# EAGLE design arduboy-gt (EAGLE 7.7.0)
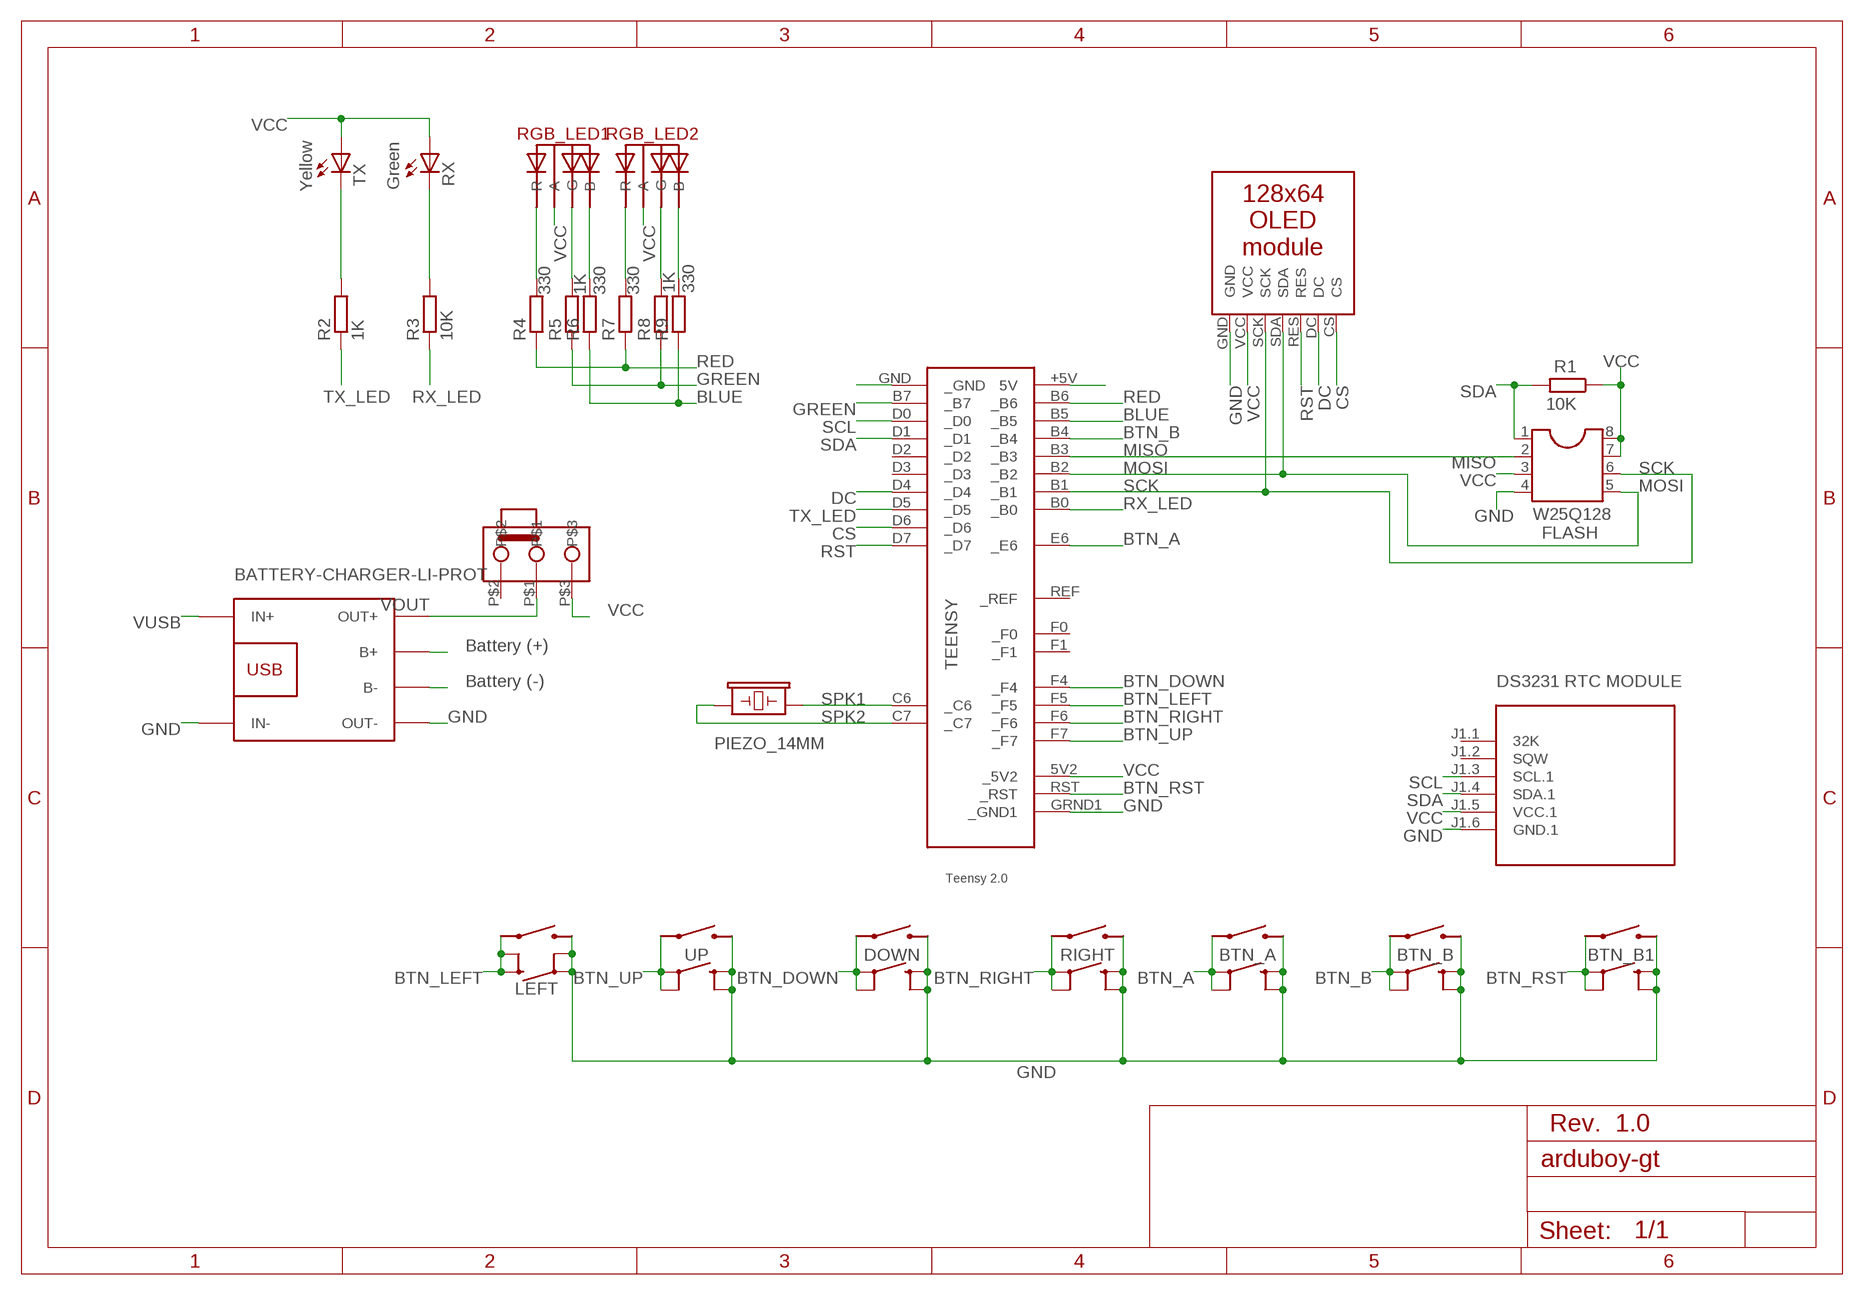
[diagram p0: schematic, sheet 1]

## Parts
_1  TEENSY  [TEENSY]
BTN_A  MOMENTARY-SWITCH-SPST-PTH-6.0MM  [TACTILE_SWITCH_PTH_6.0MM]
BTN_A_  KAIHLMICROSWITCH  [KAIHLMICROSWITCH]
BTN_B  MOMENTARY-SWITCH-SPST-PTH-6.0MM  [TACTILE_SWITCH_PTH_6.0MM]
BTN_B1  MOMENTARY-SWITCH-SPST-PTH-6.0MM  [TACTILE_SWITCH_PTH_6.0MM]
BTN_B_  KAIHLMICROSWITCH  [KAIHLMICROSWITCH]
BTN_B_1  KAIHLMICROSWITCH  [KAIHLMICROSWITCH]
DOWN  MOMENTARY-SWITCH-SPST-PTH-6.0MM  [TACTILE_SWITCH_PTH_6.0MM]
DOWN_  KAIHLMICROSWITCH  [KAIHLMICROSWITCH]
FLASH  W25Q128  DIL8  [DIL08]
LEFT  MOMENTARY-SWITCH-SPST-PTH-6.0MM  [TACTILE_SWITCH_PTH_6.0MM]
LEFT_  KAIHLMICROSWITCH  [KAIHLMICROSWITCH]
R1  10K  R-EU_0204/7  [0204/7]
R2  1K  R-EU_0204/7  [0204/7]
R3  10K  R-EU_0204/7  [0204/7]
R4  330  R-EU_0204/7  [0204/7]
R5  1K  R-EU_0204/7  [0204/7]
R6  330  R-EU_0204/7  [0204/7]
R7  330  R-EU_0204/7  [0204/7]
R8  1K  R-EU_0204/7  [0204/7]
R9  330  R-EU_0204/7  [0204/7]
RGB_LED1  5MMRGBLED-CA  [LED5MMRGB]
RGB_LED2  5MMRGBLED-CA  [LED5MMRGB]
RIGHT  MOMENTARY-SWITCH-SPST-PTH-6.0MM  [TACTILE_SWITCH_PTH_6.0MM]
RIGHT_  KAIHLMICROSWITCH  [KAIHLMICROSWITCH]
RX  TLLG4400  [LED3MM]
SG1  PIEZO_14MM  [PIEZO_14MM]
TX  TLLY4400  [LED3MM]
U$1  OLED  [OLED]
U$2  SWITCH  [SWITCH]
U$3  BATTERY-CHARGER-LI-PROT  [BATTERY-CHARGER-LI-PROT]
U$6  DS3231 RTC MODULE  RTC-DS3231-AT24C32  [RTC-DS3231-AT24C32]
UP  MOMENTARY-SWITCH-SPST-PTH-6.0MM  [TACTILE_SWITCH_PTH_6.0MM]
UP_  KAIHLMICROSWITCH  [KAIHLMICROSWITCH]

## Nets
BLUE: _1.B5(_B5) R6.1 R9.1
BTN_A: _1.E6(_E6) BTN_A.1 BTN_A.2 BTN_A_.P$1
BTN_B: _1.B4(_B4) BTN_B.1 BTN_B.2 BTN_B_.P$1
BTN_DOWN: _1.F4(_F4) DOWN.1 DOWN.2 DOWN_.P$1
BTN_LEFT: _1.F5(_F5) LEFT.3 LEFT.4 LEFT_.P$1
BTN_RIGHT: _1.F6(_F6) RIGHT.1 RIGHT.2 RIGHT_.P$1
BTN_RST: _1.RST(_RST) BTN_B1.1 BTN_B1.2 BTN_B_1.P$1
BTN_UP: _1.F7(_F7) UP.1 UP.2 UP_.P$1
CS: _1.D6(_D6) U$1.CS
DC: _1.D4(_D4) U$1.DC
GND: _1.GND(_GND) _1.GRND1(_GND1) BTN_A.3 BTN_A.4 BTN_A_.P$2 BTN_B1.3 BTN_B1.4 BTN_B.3 BTN_B.4 BTN_B_1.P$2 BTN_B_.P$2 DOWN.3 DOWN.4 DOWN_.P$2 FLASH.4 LEFT.1 LEFT.2 LEFT_.P$2 RIGHT.3 RIGHT.4 RIGHT_.P$2 U$1.GND U$3.IN- U$3.OUT- U$6.J1.6(GND.1) UP.3 UP.4 UP_.P$2
GREEN: _1.B7(_B7) R5.1 R8.1
MISO: _1.B3(_B3) FLASH.2
MOSI: _1.B2(_B2) FLASH.5 U$1.SDA
N$3: U$3.B-
N$4: U$3.B+
N$9: R7.2 RGB_LED2.R$1(R)
N$11: R8.2 RGB_LED2.G$1(G)
N$12: R9.2 RGB_LED2.B$1(B)
N$14: R6.2 RGB_LED1.B$1(B)
N$15: R5.2 RGB_LED1.G$1(G)
N$16: R4.2 RGB_LED1.R$1(R)
RED: _1.B6(_B6) R4.1 R7.1
RST: _1.D7(_D7) U$1.RES
RX_LED: _1.B0(_B0) R3.1
RX_LED_R: R3.2 RX.K(C)
SCK: _1.B1(_B1) FLASH.6 U$1.SCK
SCL: _1.D0(_D0) U$6.J1.3(SCL.1)
SDA: _1.D1(_D1) FLASH.1 R1.2 U$6.J1.4(SDA.1)
SPK1: _1.C6(_C6) SG1.P$2
SPK2: _1.C7(_C7) SG1.P$1
TX_LED: _1.D5(_D5) R2.1
TX_LED_R: R2.2 TX.K(C)
VCC: _1.5V2(_5V2) _1.+5V(5V) FLASH.3 FLASH.7 FLASH.8 R1.1 RGB_LED1.C$1(A) RGB_LED2.C$1(A) RX.A TX.A U$1.VCC U$2.P$3 U$6.J1.5(VCC.1)
VOUT: U$2.P$1 U$3.OUT+
VUSB: U$3.IN+
Unconnected: _1.D2(_D2) _1.D3(_D3) _1.F0(_F0) _1.F1(_F1) _1.REF(_REF) U$2.P$2 U$6.J1.1(32K) U$6.J1.2(SQW)

## Notes on the sheet
- Yellow | Green
- Battery (+)
- Battery (-)
- Rev.  1.0

## Library data of the parts
_1 = teensy:TEENSY: Teensy 2.0 Original Design by Clint Fisher Modified Design by Tamir Emran Licensed Under Creative Commons Attribution-ShareAlike 3.0 Unported (CC BY-SA 3.0)
BTN_A BTN_B BTN_B1 DOWN LEFT RIGHT UP = libavr-hvsp-programmer:MOMENTARY-SWITCH-SPST: Momentary Switch (Pushbutton) - SPST Normally-open (NO) SPST momentary switches (buttons, pushbuttons). Variants PTH-12MM - 12mm square, through-hole Momentary Pushbutton Switch - 12mm Square <https://www.sparkfun.com/products/9190> (COM-09190) PTH-6.0MM, PTH-6.0MM-KIT - 6.0mm square, through-hole Mini Pushbutton Switch <https://www.sparkfun.com/products/97> (COM-00097) KIT package intended for soldering kit's - only one side of pads' copper is exposed. PTH-RIGHT-ANGLE-KIT - Right-angle, through-hole Right Angle Tactile Button <https://www.sparkfun.com/products/10791> - Used on SparkFun BigTime Watch Kit <https://www.sparkfun.com/products/11734> SMD-12MM - 12mm square, surface-mount Tactile Button - SMD (12mm) <https://www.sparkfun.com/products/12993> (COM-12993) Used on SparkFun PicoBoard <https://www.sparkfun.com/products/11888> SMD-4.5MM - 4.5mm Square Trackball Switch Used on SparkFun Blackberry Trackballer Breakout <https://www.sparkfun.com/products/13169> SMD-4.6MMX2.8MM - 4.60mm x 2.80mm, surface mount Used on SparkFun SAMD21 Mini Breakout <https://www.sparkfun.com/products/13664> SMD-5.2MM, SMD-5.2-REDUNDANT - 5.2mm square, surface-mount Mini Pushbutton Switch - SMD <https://www.sparkfun.com/products/8720> (COM-08720) Used on Arduino Pro Mini <https://www.sparkfun.com/products/11114> REDUNDANT package connects both switch circuits together SMD-6.0X3.5MM - 6.0 x 3.5mm, surface mount Momentary Reset Switch SMD <https://www.sparkfun.com/products/8229> (COM-08229) SMD-6.2MM-TALL - 6.2mm square, surface mount Tactile Button - SMD (6mm) <https://www.sparkfun.com/products/12992> Used on SparkFun Digital Sandbox <https://www.sparkfun.com/products/12651> SMD-RIGHT-ANGLE - Right-angle, surface mount Used on SparkFun Block for Intel® Edison - Arduino <https://www.sparkfun.com/products/13036>; PROD_ID: SWCH-08441; SF_SKU: COM-00097
BTN_A_ BTN_B_ BTN_B_1 DOWN_ LEFT_ RIGHT_ UP_ = kaihl-microswitch:KAIHLMICROSWITCH: Kaihl microswitch 6mm
FLASH = avr-hvsp-programmer:DIL8: Dual In Line / Socket
R1-R9 = rcl:R-EU_: RESISTOR, European symbol
RGB_LED1 RGB_LED2 = led_rgb:5MMRGBLED-CA
RX = led:TLLG4400: Low Current (2mA) LED 3 mm Tinted Diffused Package color GREEN Source: Data sheet <http://www.farnell.com/datasheets/391098.pdf>; MF: VISHAY SEMICONDUCTOR; OC_FARNELL: 1612435
SG1 = buzzer:PIEZO_14MM: diameter 14 mm height 6.5 mm pin spacing 7,62 mm
TX = led:TLLY4400: Low Current (2mA) LED 3 mm Tinted Diffused Package color YELLOW Source: Data sheet <http://www.farnell.com/datasheets/391098.pdf>; MF: VISHAY SEMICONDUCTOR; OC_FARNELL: 1612439
U$1 = oled_spi_154:OLED
U$2 = oled_spi_154:SWITCH
U$3 = diy-modules:BATTERY-CHARGER-LI-PROT: Lithium Battery 5V Charger with protection circuit More details available here: http://www.instructables.com/id/DIY-Lithium-ion-Battery-Charger/step4/TP4056-based-lithium-ion-battery-charger-module/ Click here to find device on ebay.com <http://www.ebay.com/sch/tp4056+charger+usb+protection>
U$6 = rtc-module:RTC-DS3231-AT24C32: RTC Module with Battery and EEPROM based on DS3231 and AT24C32 chips Tutorial can be found here: https://edwardmallon.wordpress.com/2014/05/21/using-a-cheap-3-ds3231-rtc-at24c32-eeprom-from-ebay/ Click here to find device on ebay.com <http://www.ebay.com/sch/DS3231+AT24C32+module>

## Board
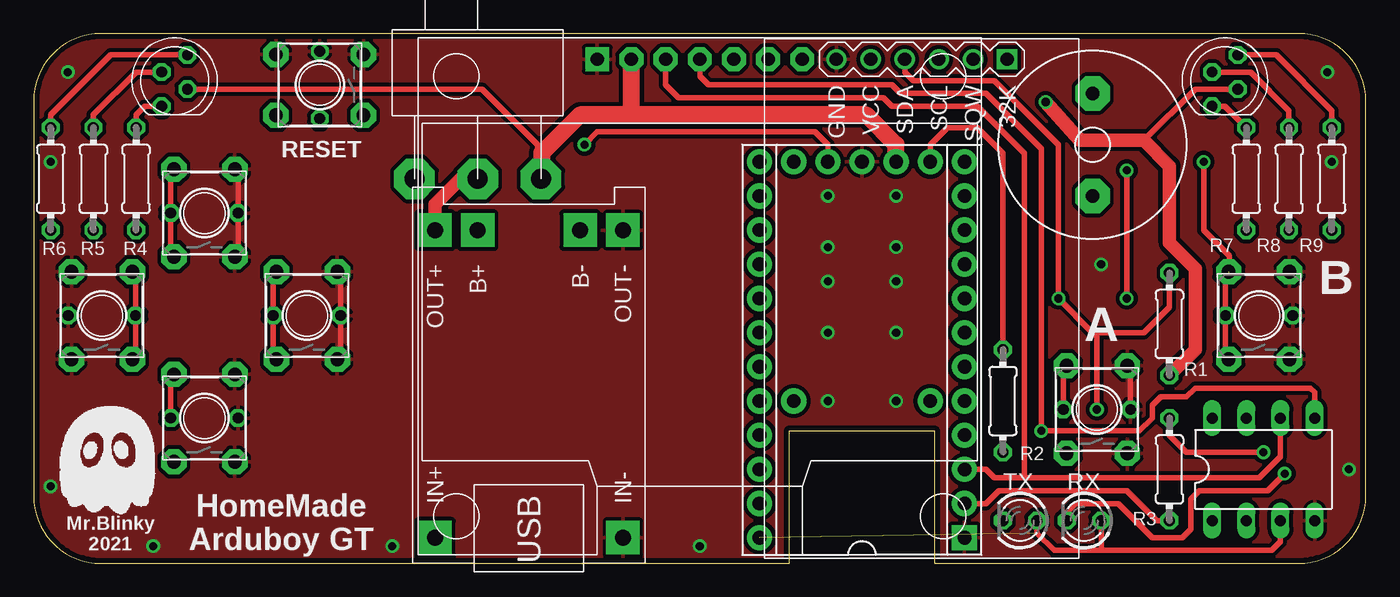
[diagram p1: board, top side]
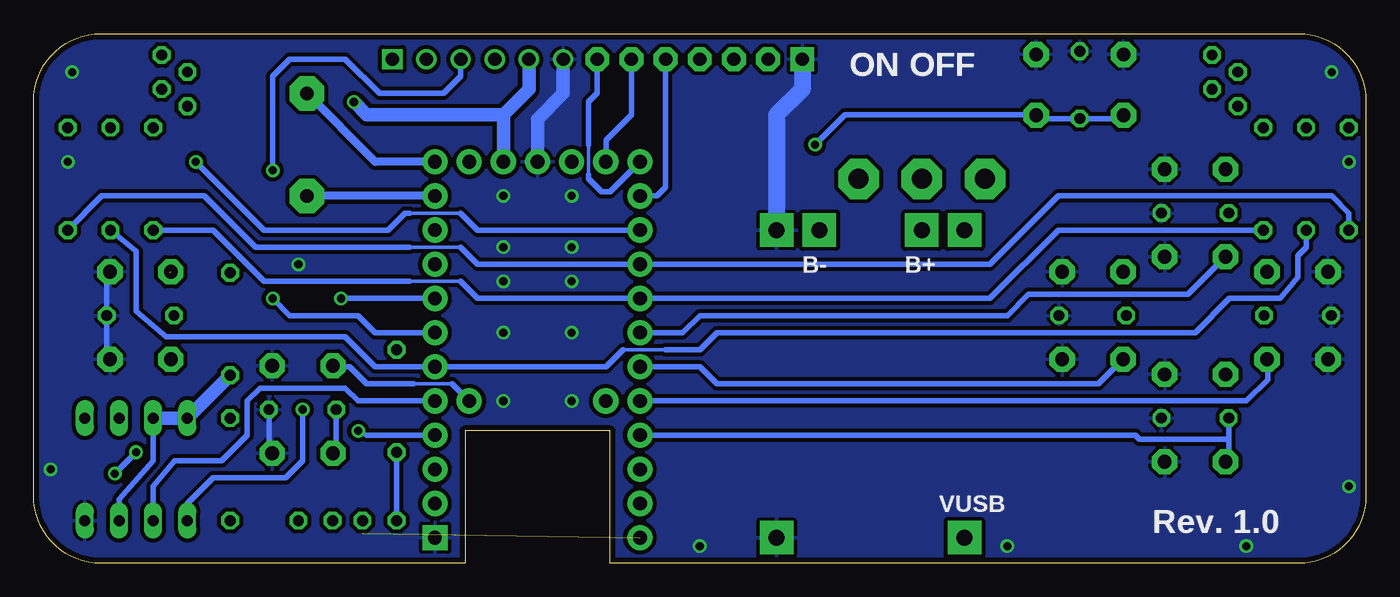
[diagram p2: board, bottom side, seen from below]

Size 99.06 x 39.37 mm. Coordinates in mm from the lower left corner, seen from the top.
Outline: 99.06,5 99.06,34.37 arc90 94.06,39.37 5,39.37 arc90 0,34.37 0,5 arc90 5,0 56.2,0 56.2,9.84 66.99,9.84 66.99,0 94.06,0 arc90 99.06,5
Copper layers (1*16): Top 0.035mm / dielectric 1.5mm / Bottom 0.035mm
Design rules "default *": minimum track width 10mil, minimum drill 24mil, track to track 8mil, track to pad 8mil, pad to pad 8mil, via to via 8mil, smd to smd 8mil, copper to edge 16mil, drill to drill 8mil, minimum pad ring 10mil, minimum via ring 8mil, stop-mask expansion 4mil, vias tented up to drill 30mil, thermal gap 10mil

### Footprints (pad centres in the part's own frame; a part is rotated, then mirrored left to right if it is on the bottom)
TEENSY = drill 1.016 pad 1.88: 5V2 13.97,-2.54; +5V -13.97,7.62; B0 -11.43,-7.62; B1 -8.89,-7.62; B2 -6.35,-7.62; B3 -3.81,-7.62; B4 8.89,7.62; B5 6.35,7.62; B6 3.81,7.62; B7 -1.27,-7.62; C6 11.43,-7.62; C7 13.97,-7.62; D0 1.27,-7.62; D1 3.81,-7.62; D2 6.35,-7.62; D3 8.89,-7.62; D4 13.97,5.08; D5 13.97,-5.08; D6 13.97,7.62; D7 11.43,7.62; E6 -3.81,-5.08; F0 -11.43,7.62; F1 -8.89,7.62; F4 -6.35,7.62; F5 -3.81,7.62; F6 -1.27,7.62; F7 1.27,7.62; GRND1 13.97,0; REF -3.81,5.08; RST 13.97,2.54 | drill 1.016 pad 1.88 square: GND -13.97,-7.62
TACTILE_SWITCH_PTH_6.0MM = drill 1.016 pad 1.88 octagon: 1 -3.251,2.261; 2 3.251,2.261; 3 -3.251,-2.261; 4 3.251,-2.261
KAIHLMICROSWITCH = drill 0.8 octagon: P$1 -2.5,0; P$2 2.5,0
DIL08 = drill 0.813 long: 1 -3.81,-3.81; 2 -1.27,-3.81; 3 1.27,-3.81; 4 3.81,-3.81; 5 3.81,3.81; 6 1.27,3.81; 7 -1.27,3.81; 8 -3.81,3.81
0204/7 = drill 0.813 octagon: 1 -3.81,0; 2 3.81,0
LED5MMRGB = drill 0.8 pad 1.27 octagon: B$1 1.905,-0.953; C$1 -0.635,-0.953; G$1 0.635,0.953; R$1 -1.905,0.953
LED3MM = drill 0.813 octagon: A -1.27,0; K 1.27,0
PIEZO_14MM = drill 1.016 pad 2.54 octagon: P$1 -3.81,0; P$2 3.81,0
OLED = drill 1 pad 1.778 octagon: CS 7.62,17.78; DC 5.08,17.78; RES 2.54,17.78; SCK -2.54,17.78; SDA 0,17.78; VCC -5.08,17.78 | drill 1 pad 1.778 square: GND -7.62,17.78
SWITCH = drill 1.5 pad 3 octagon: P$1 0,0; P$2 -4.7,0; P$3 4.7,0
BATTERY-CHARGER-LI-PROT = drill 1.2 pad 2.5 square: B+ 10.795,3.81; B- 10.795,-3.81; IN+ -12.065,6.985; IN- -12.065,-6.985; OUT+ 10.795,6.985; OUT- 10.795,-6.985
RTC-DS3231-AT24C32 = drill 1 square: J1.1 -17.78,6.35 | drill 1: J1.2 -17.78,3.81; J1.3 -17.78,1.27; J1.4 -17.78,-1.27; J1.5 -17.78,-3.81; J1.6 -17.78,-6.35

### Placement (x,y rotation side)
_1  61.59,15.88 90 top
BTN_A  79.06,11.43 90 top
BTN_A_  79.06,11.43 0 top
BTN_B  91.12,18.41 90 top
BTN_B1  21.27,35.56 180 top
BTN_B_  91.12,18.41 0 top
BTN_B_1  21.27,35.56 90 top
DOWN  12.7,10.8 90 top
DOWN_  12.7,10.8 0 top
FLASH  91.44,6.98 0 top
LEFT  5.08,18.41 90 top
LEFT_  5.08,18.41 180 top
R1  84.45,17.78 90 top
R2  72.07,12.06 270 top
R3  84.45,6.98 90 top
R4  7.62,28.58 90 top
R5  4.45,28.58 90 top
R6  1.27,28.58 90 top
R7  90.17,28.58 90 top
R8  93.34,28.58 90 top
R9  96.52,28.58 90 top
RGB_LED1  10.48,35.88 90 top
RGB_LED2  88.58,35.88 90 top
RIGHT  20.32,18.41 90 top
RIGHT_  20.32,18.41 0 top
RX  78.11,3.18 180 top
SG1  78.74,31.12 270 top
TX  73.34,3.18 180 top
U$1  49.53,19.69 0 top
U$2  33.02,28.58 0 top
U$3  36.83,13.97 90 top
U$6  66.04,19.69 270 top
UP  12.7,26.04 90 top
UP_  12.7,26.04 0 top

### Tracks (layer width: path | path; a pad name or v marks a point on that pad's centre or on a via)
BLUE
  Bottom 0.254: 67.31,23.5 71.12,23.5
  Bottom 0.406: 67.31,23.5 66.04,22.23 _1.B5 27.94,22.23 22.86,27.3 2.54,27.3 1.27,26.04 R6.1 | 71.12,23.5 82.55,23.5 86.36,27.3 93.98,27.3 R9.1
BTN_A
  Top 0.406: BTN_A_.P$1 76.56,14.44 BTN_A.2
  Bottom 0.254: 67.94,13.34 70.8,13.34
  Bottom 0.406: _1.E6 67.94,13.34 | 70.8,13.34 74.3,13.34 75.56,14.61 76.52,14.61 76.59,14.68 BTN_A.2 | BTN_A_.P$1 76.56,8.18 BTN_A.1
BTN_B  (via drill 0.6)  (1 unrouted)
  Top 0.406: v87,29.84 87,24.77 88.9,22.86 88.9,22.23 88.9,21.59 88.62,21.59 BTN_B_.P$1 88.62,15.4 BTN_B.1
  Bottom 0.254: 67.31,26.04 71.12,26.04
  Bottom 0.406: _1.B4 66.04,24.77 67.31,26.04 | 71.12,26.04 71.44,26.04 72.71,24.77 81.92,24.77 v87,29.84
BTN_DOWN
  Top 0.406: DOWN_.P$1 10.2,13.81 DOWN.2
  Bottom 0.406: _1.F4 17.14,9.52 16.83,9.21 10.2,9.21 | 10.2,9.21 DOWN_.P$1 | 10.2,9.21 10.2,7.78 DOWN.1
BTN_LEFT
  Top 0.406: LEFT.4 7.58,21.43 LEFT_.P$1 7.58,15.4 LEFT.3
  Bottom 0.406: _1.F5 8.89,12.06 7.3,13.65 7.3,15.13 LEFT.3
BTN_RIGHT
  Top 0.406: RIGHT.2 arc90 17.82,21.43 RIGHT_.P$1 17.82,15.4 arc90 RIGHT.1
  Bottom 0.406: _1.F6 49.53,14.61 48.26,13.34 19.89,13.34 RIGHT.1
BTN_RST  (via drill 0.6)
  Top 0.406: _1.RST 59.05,31.12 58.1,32.07 41.91,32.07 v40.96,31.12
  Bottom 0.406: v40.96,31.12 38.73,33.34 24.56,33.34 BTN_B1.1 arc-90 24.28,33.06 BTN_B_1.P$1 18.26,33.06 BTN_B1.2
BTN_UP
  Top 0.406: UP.1 10.2,23.02 UP_.P$1 10.2,29.05 UP.2
  Bottom 0.406: _1.F7 50.8,17.15 49.53,18.41 26.67,18.41 25.08,20 13.22,20 UP.1
CS
  Bottom 0.254: 57.78,31.12 57.78,28.89
  Bottom 0.406: U$1.CS 57.15,34.92 57.78,34.29 57.78,31.12 | 57.78,28.89 57.78,28.58 56.83,27.62 56.2,27.62 _1.D6
DC
  Bottom 0.406: U$1.DC 54.61,33.34 56.52,31.43 _1.D4
GND  (via drill 0.6)
  Top 0.406: BTN_A_.P$2 81.56,14.44 BTN_A.4 | RIGHT.4 22.82,21.43 RIGHT_.P$2 22.82,15.16 RIGHT.3 | UP.4 15.2,29.05 UP_.P$2 15.2,23.02 arc-90 UP.3
  Bottom 0.406: BTN_A_.P$2 81.56,8.18 BTN_A.3 | BTN_B.4 arc-90 93.62,21.43 BTN_B_.P$2 93.62,15.4 arc-90 BTN_B.3
  Bottom 1.016: _1.GRND1 61.59,33.02 59.69,34.92 U$6.J1.6
  Bottom 1.27: U$1.GND 41.91,35.24 43.81,33.34 U$3.OUT-
  other vias: 64.14,23.5 64.14,20.95 64.14,17.15 59.05,23.5 59.05,20.95 59.05,17.15 64.14,12.06 59.05,12.06 49.53,1.27 26.67,1.27 1.27,5.72 1.27,29.84 2.54,36.51 97.79,6.98 96.2,36.51 96.52,29.84 64.14,27.3 59.05,27.3 79.38,22.23 8.89,1.27
  pour Bottom (isolate 0.305): 0,39.37 99.06,39.37 99.06,0 0,0
  pour Top (isolate 0.305): 0,39.37 99.06,39.37 99.06,0 0,0
GREEN
  Bottom 0.254: 55.24,15.88 52.07,15.88
  Bottom 0.406: R8.1 91.44,23.18 91.44,18.73 89.22,16.83 75.88,16.83 73.66,14.61 _1.B7 56.52,14.61 55.24,15.88 | 52.07,15.88 49.53,15.88 48.26,17.15 12.7,17.15 10.16,19.69 6.35,19.69 5.08,21.27 5.08,22.86 4.45,23.5 R5.1
MISO
  Bottom 0.406: _1.B3 74.93,12.06 75.88,13.02 82.23,13.02 83.19,12.06 83.19,9.52 85.09,7.62 88.58,7.62 90.17,5.72 FLASH.2
MOSI  (via drill 0.6)
  Top 0.406: U$1.SDA 49.53,36.2 50.16,35.56 63.82,35.56 64.45,34.92 70.8,34.92 74.93,30.8 v74.93,9.84 82.23,9.84 83.19,10.8 83.19,11.75 83.82,12.38 85.72,12.38 86.36,13.02 94.93,13.02 95.25,12.7 FLASH.5
  Bottom 0.406: v74.93,9.84 74.3,9.52 _1.B2
N$9
  Top 0.406: RGB_LED2.R$1 88.58,33.97 R7.2
N$11
  Top 0.406: RGB_LED2.G$1 90.49,36.51 93.34,33.66 R8.2
N$12
  Top 0.406: RGB_LED2.B$1 92.39,37.78 96.52,33.66 R9.2
N$14
  Top 0.406: R6.2 1.27,33.34 5.71,37.78 RGB_LED1.B$1
N$15
  Top 0.406: RGB_LED1.G$1 7.62,36.51 4.45,33.34 R5.2
N$16
  Top 0.406: RGB_LED1.R$1 8.26,33.97 7.62,33.34 R4.2
RED
  Bottom 0.254: 67.31,20.95 71.12,20.95
  Bottom 0.406: 67.31,20.95 66.04,19.69 _1.B6 27.94,19.69 22.86,24.77 R4.1 | 71.12,20.95 81.92,20.95 85.72,24.77 R7.1
RST
  Bottom 0.406: U$1.RES 52.07,27.94 52.7,27.3 _1.D7
RX_LED
  Top 0.406: _1.B0 70.8,4.45 71.75,5.4 81.28,5.4 83.5,3.18 R3.1
RX_LED_R  (via drill 0.6)
  Top 0.406: RX.K 76.83,3.81 77.47,4.45 80.64,4.45 83.19,1.91 85.41,1.91 86.04,2.54 86.04,4.76 86.68,5.4 91.76,5.4 v93.03,6.67 | R3.2 84.45,9.52 85.72,8.26 v91.44,8.26
  Bottom 0.406: v93.03,6.67 v91.44,8.26
SCK
  Top 0.406: _1.B1 70.8,6.98 71.44,6.35 73.66,6.35 | 73.66,6.35 73.66,30.48 70.17,33.97 63.82,33.97 63.18,34.61 47.94,34.61 46.99,35.56 U$1.SCK | FLASH.6 92.71,7.94 91.12,6.35 73.66,6.35
SCL  (via drill 0.6)
  Top 0.406: v81.28,29.21 v81.28,19.69
  Bottom 0.406: U$6.J1.3 67.31,36.2 68.58,34.92 73.34,34.92 75.88,37.47 80.01,37.47 81.28,36.2 v81.28,29.21 | v81.28,19.69 80.01,18.41 74.93,18.41 73.66,17.15 _1.D0
SDA  (via drill 0.6)
  Top 0.406: U$6.J1.4 64.77,36.51 65.41,35.88 71.44,35.88 76.2,31.12 v76.2,19.69 78.74,17.15 | v79.06,11.43 79.06,16.83 78.74,17.15 | R1.2 84.45,19.05 82.55,17.15 78.74,17.15
  Bottom 0.406: v79.06,11.43 79.06,7.62 80.33,6.35 85.72,6.35 87.63,4.45 FLASH.1 | _1.D1 v76.2,19.69
SPK1
  Bottom 0.61: _1.C6 SG1.P$2
SPK2
  Bottom 0.61: _1.C7 73.66,29.84 SG1.P$1
TX_LED
  Top 0.406: R2.1 72.07,30.48 70.17,32.38 67.94,32.38 66.67,31.12 _1.D5
TX_LED_R
  Bottom 0.406: R2.2 TX.K
VCC  (via drill 0.6)  (1 unrouted)
  Top 0.406: RGB_LED1.C$1 33.34,35.24 37.47,31.12 37.47,28.83 | RGB_LED2.C$1 86.36,35.24 82.55,31.43 | FLASH.3 92.71,1.59 92.08,0.95 79.38,0.95 | 79.38,0.95 RX.A | TX.A 74.61,2.22 75.88,0.95 79.38,0.95
  Top 0.61: 37.47,28.83 U$2.P$3
  Top 0.813: 37.78,28.58 U$2.P$3
  Top 1.016: v75.25,34.29 77.79,31.43 82.55,31.43 84.45,29.53 84.45,23.81 86.36,21.91 86.36,15.88 R1.1
  Top 1.27: _1.5V2 64.14,31.12 61.91,33.34 44.45,33.34 | 44.45,33.34 40.64,33.34 37.78,30.48 37.78,28.58 | 44.45,33.34 U$1.VCC
  Bottom 0.406: FLASH.3 92.71,4.76 90.17,7.62 FLASH.7
  Bottom 1.016: _1.5V2 64.14,33.34 | 64.14,33.34 62.23,35.24 U$6.J1.5 | v75.25,34.29 74.3,33.34 64.14,33.34 | FLASH.7 FLASH.8 R1.1
VOUT
  Top 1.016: U$2.P$1 31.75,28.58 29.84,26.67 U$3.OUT+

### Text on the board
tNames: RESET | B | A | Mr.Blinky / 2021 | HomeMade / Arduboy GT
bNames: ON OFF | B+ | B- | VUSB | Rev. 1.0